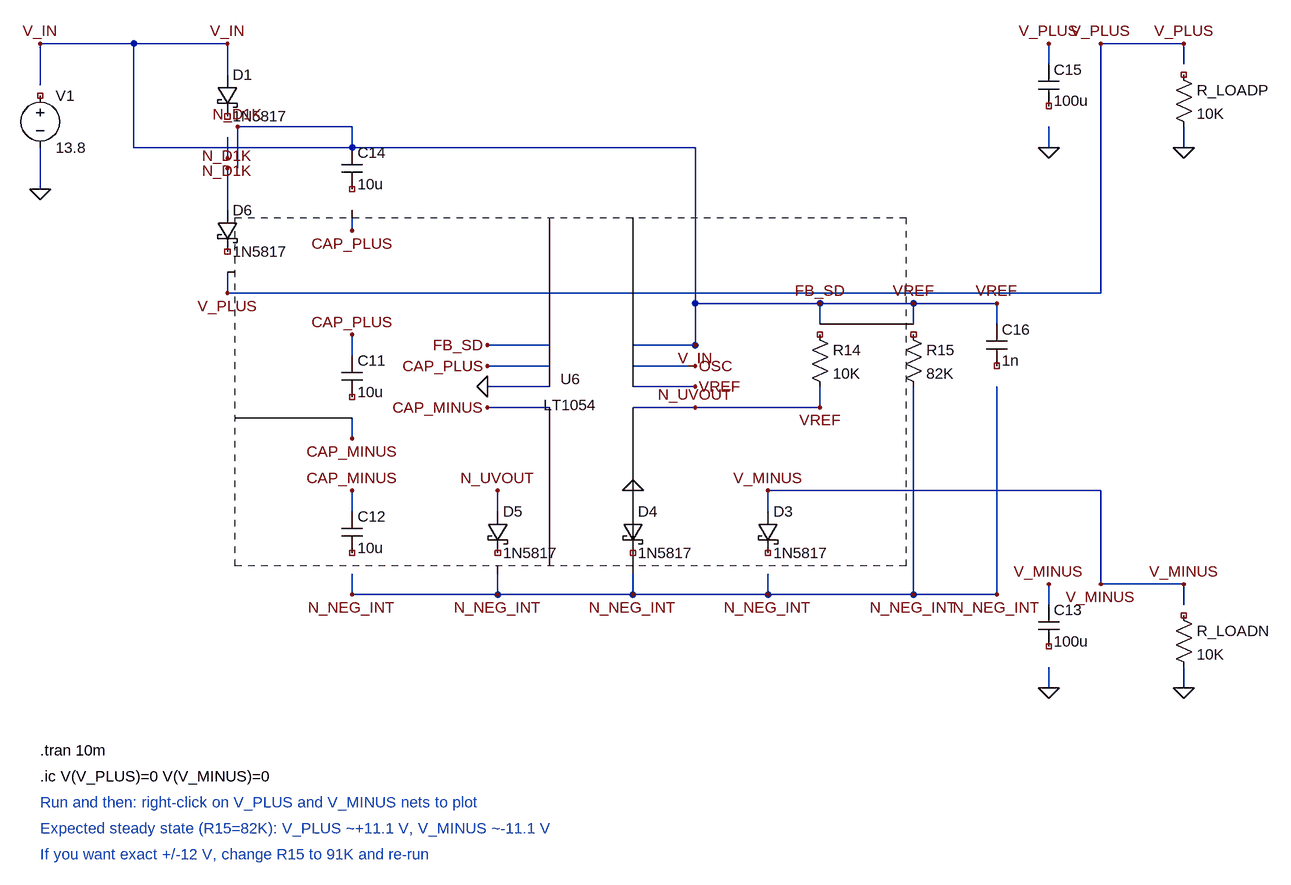
[diagram p0: schematic power_sim.asc]
power_sim.asc, the LTspice schematic file:
Version 4
SHEET 1 2048 1536

* ==========================================================================
* LT1054 Figure 22 Dual-Output Doubler, regulated via FB/VREF to approx +/-11.1 V
*
* Translated from KiCAD/power/power.net (xmitter revC)
* All connectivity is via net labels (FLAG) so geometric pin positions are not
* critical.  If LTspice shows red "unconnected" markers on any pin after you
* open this schematic, drag that pin or wire by one grid square until the
* FLAG label sits on top of the pin -- the net name does the rest.
*
* Nets:
*   V_IN       - +13.8 V supply (from your 100 W transceiver PSU)
*   V_PLUS     - +12 V (nominal +11.1 V with R15 = 82 K) regulated output
*   V_MINUS    - -12 V (nominal -11.1 V) regulated output
*   CAP_PLUS   - LT1054 pin 2 (CAP+)
*   CAP_MINUS  - LT1054 pin 4 (CAP-)
*   N_D1K      - D1 cathode / D6 anode / top plate of C14 (positive pump node)
*   N_NEG_INT  - D3 cathode / D4 anode / D5 anode (negative pump intermediate)
*   N_UVOUT    - LT1054 pin 5 (unregulated VOUT, feeds D5)
*   FB_SD      - LT1054 pin 1 (FB/SHDN)
*   VREF       - LT1054 pin 6 (VREF)
* ==========================================================================

* --- Voltage source V1: 13.8 V input ---
SYMBOL voltage 128 304 R0
WINDOW 123 0 0 Left 0
WINDOW 39 0 0 Left 0
SYMATTR InstName V1
SYMATTR Value 13.8
WIRE 128 240 128 304
WIRE 128 240 272 240
FLAG 128 240 V_IN
WIRE 128 400 128 464
FLAG 128 464 0

* --- Load resistor on +12 V rail (represents 3x op-amp quiescent, ~1 mA each) ---
SYMBOL res 1872 272 R0
SYMATTR InstName R_LOADP
SYMATTR Value 10K
WIRE 1888 272 1888 240
WIRE 1888 240 1760 240
FLAG 1888 240 V_PLUS
WIRE 1888 368 1888 400
FLAG 1888 400 0

* --- Load resistor on -12 V rail ---
SYMBOL res 1872 1104 R0
SYMATTR InstName R_LOADN
SYMATTR Value 10K
WIRE 1888 1104 1888 1072
WIRE 1888 1072 1760 1072
FLAG 1888 1072 V_MINUS
WIRE 1888 1200 1888 1232
FLAG 1888 1232 0

* ==========================================================================
* Positive doubler pump chain: V_IN -> D1 -> N_D1K -> D6 -> V_PLUS
*                              with C14 lifting N_D1K via CAP_PLUS swing
* ==========================================================================

* --- D1: schottky, anode = V_IN, cathode = N_D1K ---
SYMBOL schottky 400 288 R0
SYMATTR InstName D1
SYMATTR Value 1N5817
WIRE 416 288 416 240
WIRE 416 240 272 240
FLAG 416 240 V_IN
WIRE 416 384 416 416
FLAG 416 416 N_D1K

* --- D6: schottky, anode = N_D1K, cathode = V_PLUS ---
SYMBOL schottky 400 496 R0
SYMATTR InstName D6
SYMATTR Value 1N5817
WIRE 416 496 416 432
FLAG 416 432 N_D1K
WIRE 416 592 416 624
WIRE 416 624 1760 624
WIRE 1760 624 1760 240
FLAG 416 624 V_PLUS
FLAG 1760 240 V_PLUS

* --- C14: 10uF between N_D1K and CAP_PLUS (positive pump cap) ---
SYMBOL cap 592 400 R0
SYMATTR InstName C14
SYMATTR Value 10u
WIRE 608 400 608 368
WIRE 608 368 432 368
WIRE 432 368 432 432
FLAG 432 368 N_D1K
WIRE 608 496 608 528
FLAG 608 528 CAP_PLUS

* --- C15: 100uF +12 V output bulk cap ---
SYMBOL cap 1664 272 R0
SYMATTR InstName C15
SYMATTR Value 100u
WIRE 1680 272 1680 240
FLAG 1680 240 V_PLUS
WIRE 1680 368 1680 400
FLAG 1680 400 0

* ==========================================================================
* LT1054 U6 - the switched-cap converter itself
* Pin 1 (FB/SHDN) -> FB_SD, pin 2 (CAP+) -> CAP_PLUS, pin 3 (GND) -> 0,
* pin 4 (CAP-) -> CAP_MINUS, pin 5 (-VOUT) -> N_UVOUT, pin 6 (VREF) -> VREF,
* pin 7 (OSC) -> (left open), pin 8 (V+) -> V_IN
* ==========================================================================

* --- LT1054 ---
* Note: LT1054 is in LTspice's built-in library at (symbol path varies).
* If LTspice can't locate the symbol, open Edit -> Component and search LT1054,
* then re-place manually.  Pin position estimates below assume a standard
* DIP-8 symbol of 128 wide x 128 tall with pins on 32-unit spacing.
SYMBOL LT1054 912 672 R0
SYMATTR InstName U6
WIRE 912 704 816 704
FLAG 816 704 FB_SD
WIRE 912 736 816 736
FLAG 816 736 CAP_PLUS
WIRE 912 768 816 768
FLAG 816 768 0
WIRE 912 800 816 800
FLAG 816 800 CAP_MINUS
WIRE 1040 800 1136 800
FLAG 1136 800 N_UVOUT
WIRE 1040 768 1136 768
FLAG 1136 768 VREF
WIRE 1040 736 1136 736
FLAG 1136 736 OSC
WIRE 1040 704 1136 704
WIRE 1136 704 1136 400
WIRE 1136 400 272 400
WIRE 272 400 272 240
FLAG 1136 704 V_IN

* --- C11: 10uF flying cap between CAP_PLUS and CAP_MINUS ---
SYMBOL cap 592 720 R0
SYMATTR InstName C11
SYMATTR Value 10u
WIRE 608 720 608 688
FLAG 608 688 CAP_PLUS
WIRE 608 816 608 848
FLAG 608 848 CAP_MINUS

* ==========================================================================
* Negative pump chain: CAP_MINUS -> C12 -> N_NEG_INT
*                      and N_UVOUT -> D5 -> N_NEG_INT
*                      and GND <- D4 <- N_NEG_INT (catch diode)
*                      and V_MINUS <- D3 <- N_NEG_INT (transfer diode)
* ==========================================================================

* --- C12: 10uF between CAP_MINUS and N_NEG_INT ---
SYMBOL cap 592 960 R0
SYMATTR InstName C12
SYMATTR Value 10u
WIRE 608 960 608 928
FLAG 608 928 CAP_MINUS
WIRE 608 1056 608 1088
FLAG 608 1088 N_NEG_INT

* --- D5: schottky, anode = N_NEG_INT, cathode = N_UVOUT ---
SYMBOL schottky 816 960 R0
SYMATTR InstName D5
SYMATTR Value 1N5817
WIRE 832 960 832 928
FLAG 832 928 N_UVOUT
WIRE 832 1056 832 1088
FLAG 832 1088 N_NEG_INT

* --- D4: schottky, anode = N_NEG_INT, cathode = 0 (GND) ---
SYMBOL schottky 1024 960 R0
SYMATTR InstName D4
SYMATTR Value 1N5817
WIRE 1040 960 1040 928
FLAG 1040 928 0
WIRE 1040 1056 1040 1088
FLAG 1040 1088 N_NEG_INT

* --- D3: schottky, anode = V_MINUS, cathode = N_NEG_INT ---
SYMBOL schottky 1232 960 R0
SYMATTR InstName D3
SYMATTR Value 1N5817
WIRE 1248 960 1248 928
WIRE 1248 928 1760 928
WIRE 1760 928 1760 1072
FLAG 1248 928 V_MINUS
FLAG 1760 1072 V_MINUS
WIRE 1248 1056 1248 1088
FLAG 1248 1088 N_NEG_INT

* --- C13: 100uF -12 V output bulk cap ---
SYMBOL cap 1664 1104 R0
SYMATTR InstName C13
SYMATTR Value 100u
WIRE 1680 1104 1680 1072
FLAG 1680 1072 V_MINUS
WIRE 1680 1200 1680 1232
FLAG 1680 1232 0

* --- Horizontal rail for N_NEG_INT at y=1088 (ties D5/D4/D3/C12 bottoms) ---
WIRE 608 1088 1248 1088

* ==========================================================================
* FB loop:  VREF -- R14 (10K) -- FB_SD
*           VREF -- R15 (82K) -- N_NEG_INT
*           VREF -- C16 (1n)   -- N_NEG_INT  (loop compensation)
* ==========================================================================

* --- R14: 10K from FB_SD (top) to VREF (bottom) ---
SYMBOL res 1312 672 R0
SYMATTR InstName R14
SYMATTR Value 10K
WIRE 1328 672 1328 640
WIRE 1328 640 1136 640
WIRE 1136 640 1136 704
FLAG 1328 640 FB_SD
WIRE 1328 768 1328 800
WIRE 1328 800 1136 800
FLAG 1328 800 VREF

* --- R15: 82K from VREF (top) to N_NEG_INT (bottom) ---
SYMBOL res 1456 672 R0
SYMATTR InstName R15
SYMATTR Value 82K
WIRE 1472 672 1472 640
WIRE 1472 640 1328 640
FLAG 1472 640 VREF
WIRE 1472 768 1472 1088
WIRE 1472 1088 1248 1088
FLAG 1472 1088 N_NEG_INT

* --- C16: 1nF compensation cap, VREF to N_NEG_INT ---
SYMBOL cap 1584 672 R0
SYMATTR InstName C16
SYMATTR Value 1n
WIRE 1600 672 1600 640
WIRE 1600 640 1472 640
FLAG 1600 640 VREF
WIRE 1600 768 1600 1088
WIRE 1600 1088 1472 1088
FLAG 1600 1088 N_NEG_INT

* ==========================================================================
* Simulation directives
* ==========================================================================

TEXT 128 1328 Left 2 !.tran 10m
TEXT 128 1368 Left 2 !.ic V(V_PLUS)=0 V(V_MINUS)=0
TEXT 128 1408 Left 2 ;Run and then: right-click on V_PLUS and V_MINUS nets to plot
TEXT 128 1448 Left 2 ;Expected steady state (R15=82K): V_PLUS ~+11.1 V, V_MINUS ~-11.1 V
TEXT 128 1488 Left 2 ;If you want exact +/-12 V, change R15 to 91K and re-run

The netlist it stands for:
* power_sim.asc
V1 NC_01 0 13.8
R_LOADP NC_02 0 10K
R_LOADN NC_03 0 10K
D1 VREF NC_04 1N5817
D6 VREF NC_05 1N5817
C14 VREF NC_06 10u
C15 V_PLUS NC_07 100u
* U6: LT1054 (symbol LT1054 not available, pin order unknown); nets seen at it: 0, CAP_MINUS, CAP_PLUS, N_NEG_INT, OSC, V_PLUS, VREF
C11 CAP_PLUS NC_08 10u
C12 CAP_MINUS NC_09 10u
D5 VREF NC_10 1N5817
D4 0 NC_11 1N5817
D3 V_MINUS NC_12 1N5817
C13 V_MINUS NC_13 100u
R14 NC_14 VREF 10K
R15 NC_15 N_NEG_INT 82K
C16 VREF NC_16 1n
.model D D
.lib standard.dio
.tran 10m
.ic V(V_PLUS)=0 V(V_MINUS)=0
* Run and then: right-click on V_PLUS and V_MINUS nets to plot
* Expected steady state (R15=82K): V_PLUS ~+11.1 V, V_MINUS ~-11.1 V
* If you want exact +/-12 V, change R15 to 91K and re-run
.backanno
.end